# EasyEDA schematic LcsNodes-Extension-GPIO-Board-32-S-B.00.01.json

## Sheets
1 Connectors: TITLE: LcsNodes-Extension-Relais-Board-16-S\nConnectors; REV: B.00.01; Date: 2023-05-06; Sheet: 2/3; Drawn By: helmut-f; Company: Your Company
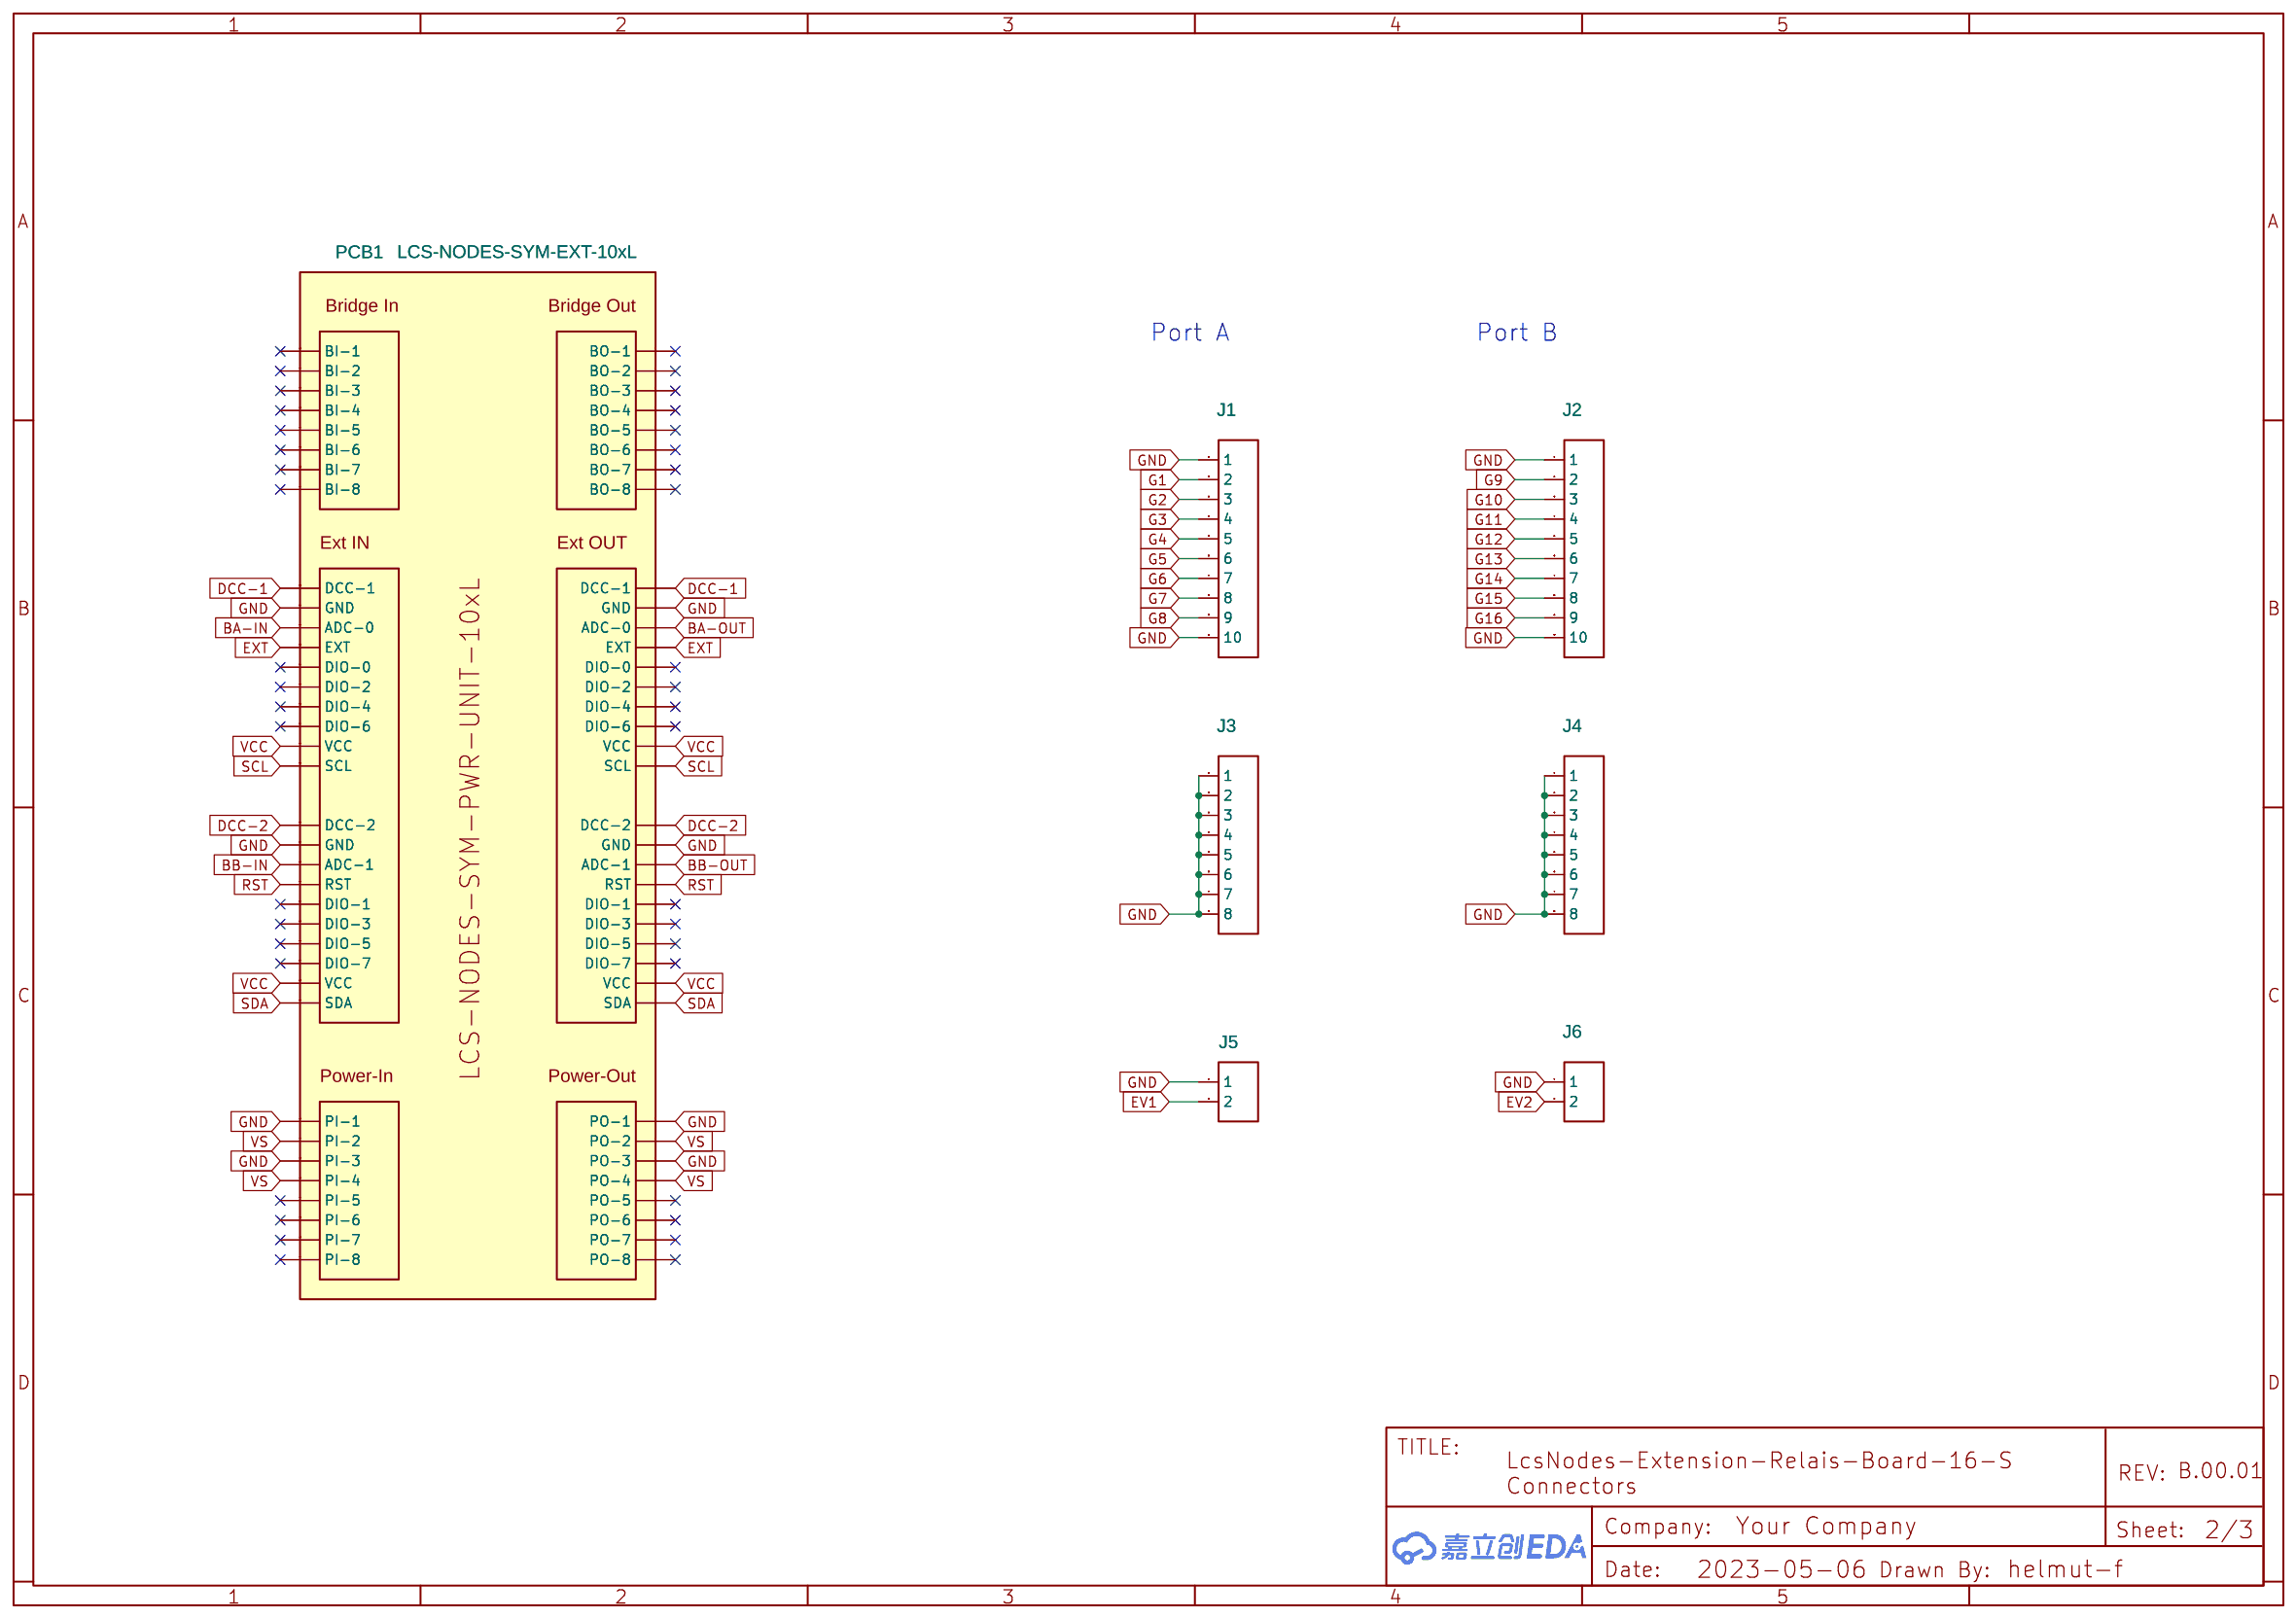
[diagram p0: Connectors]
2 Logic: TITLE: LcsNodes-Extension-Relais-Board16-S\nLogic; Date: 2023-05-07; Sheet: 3/3
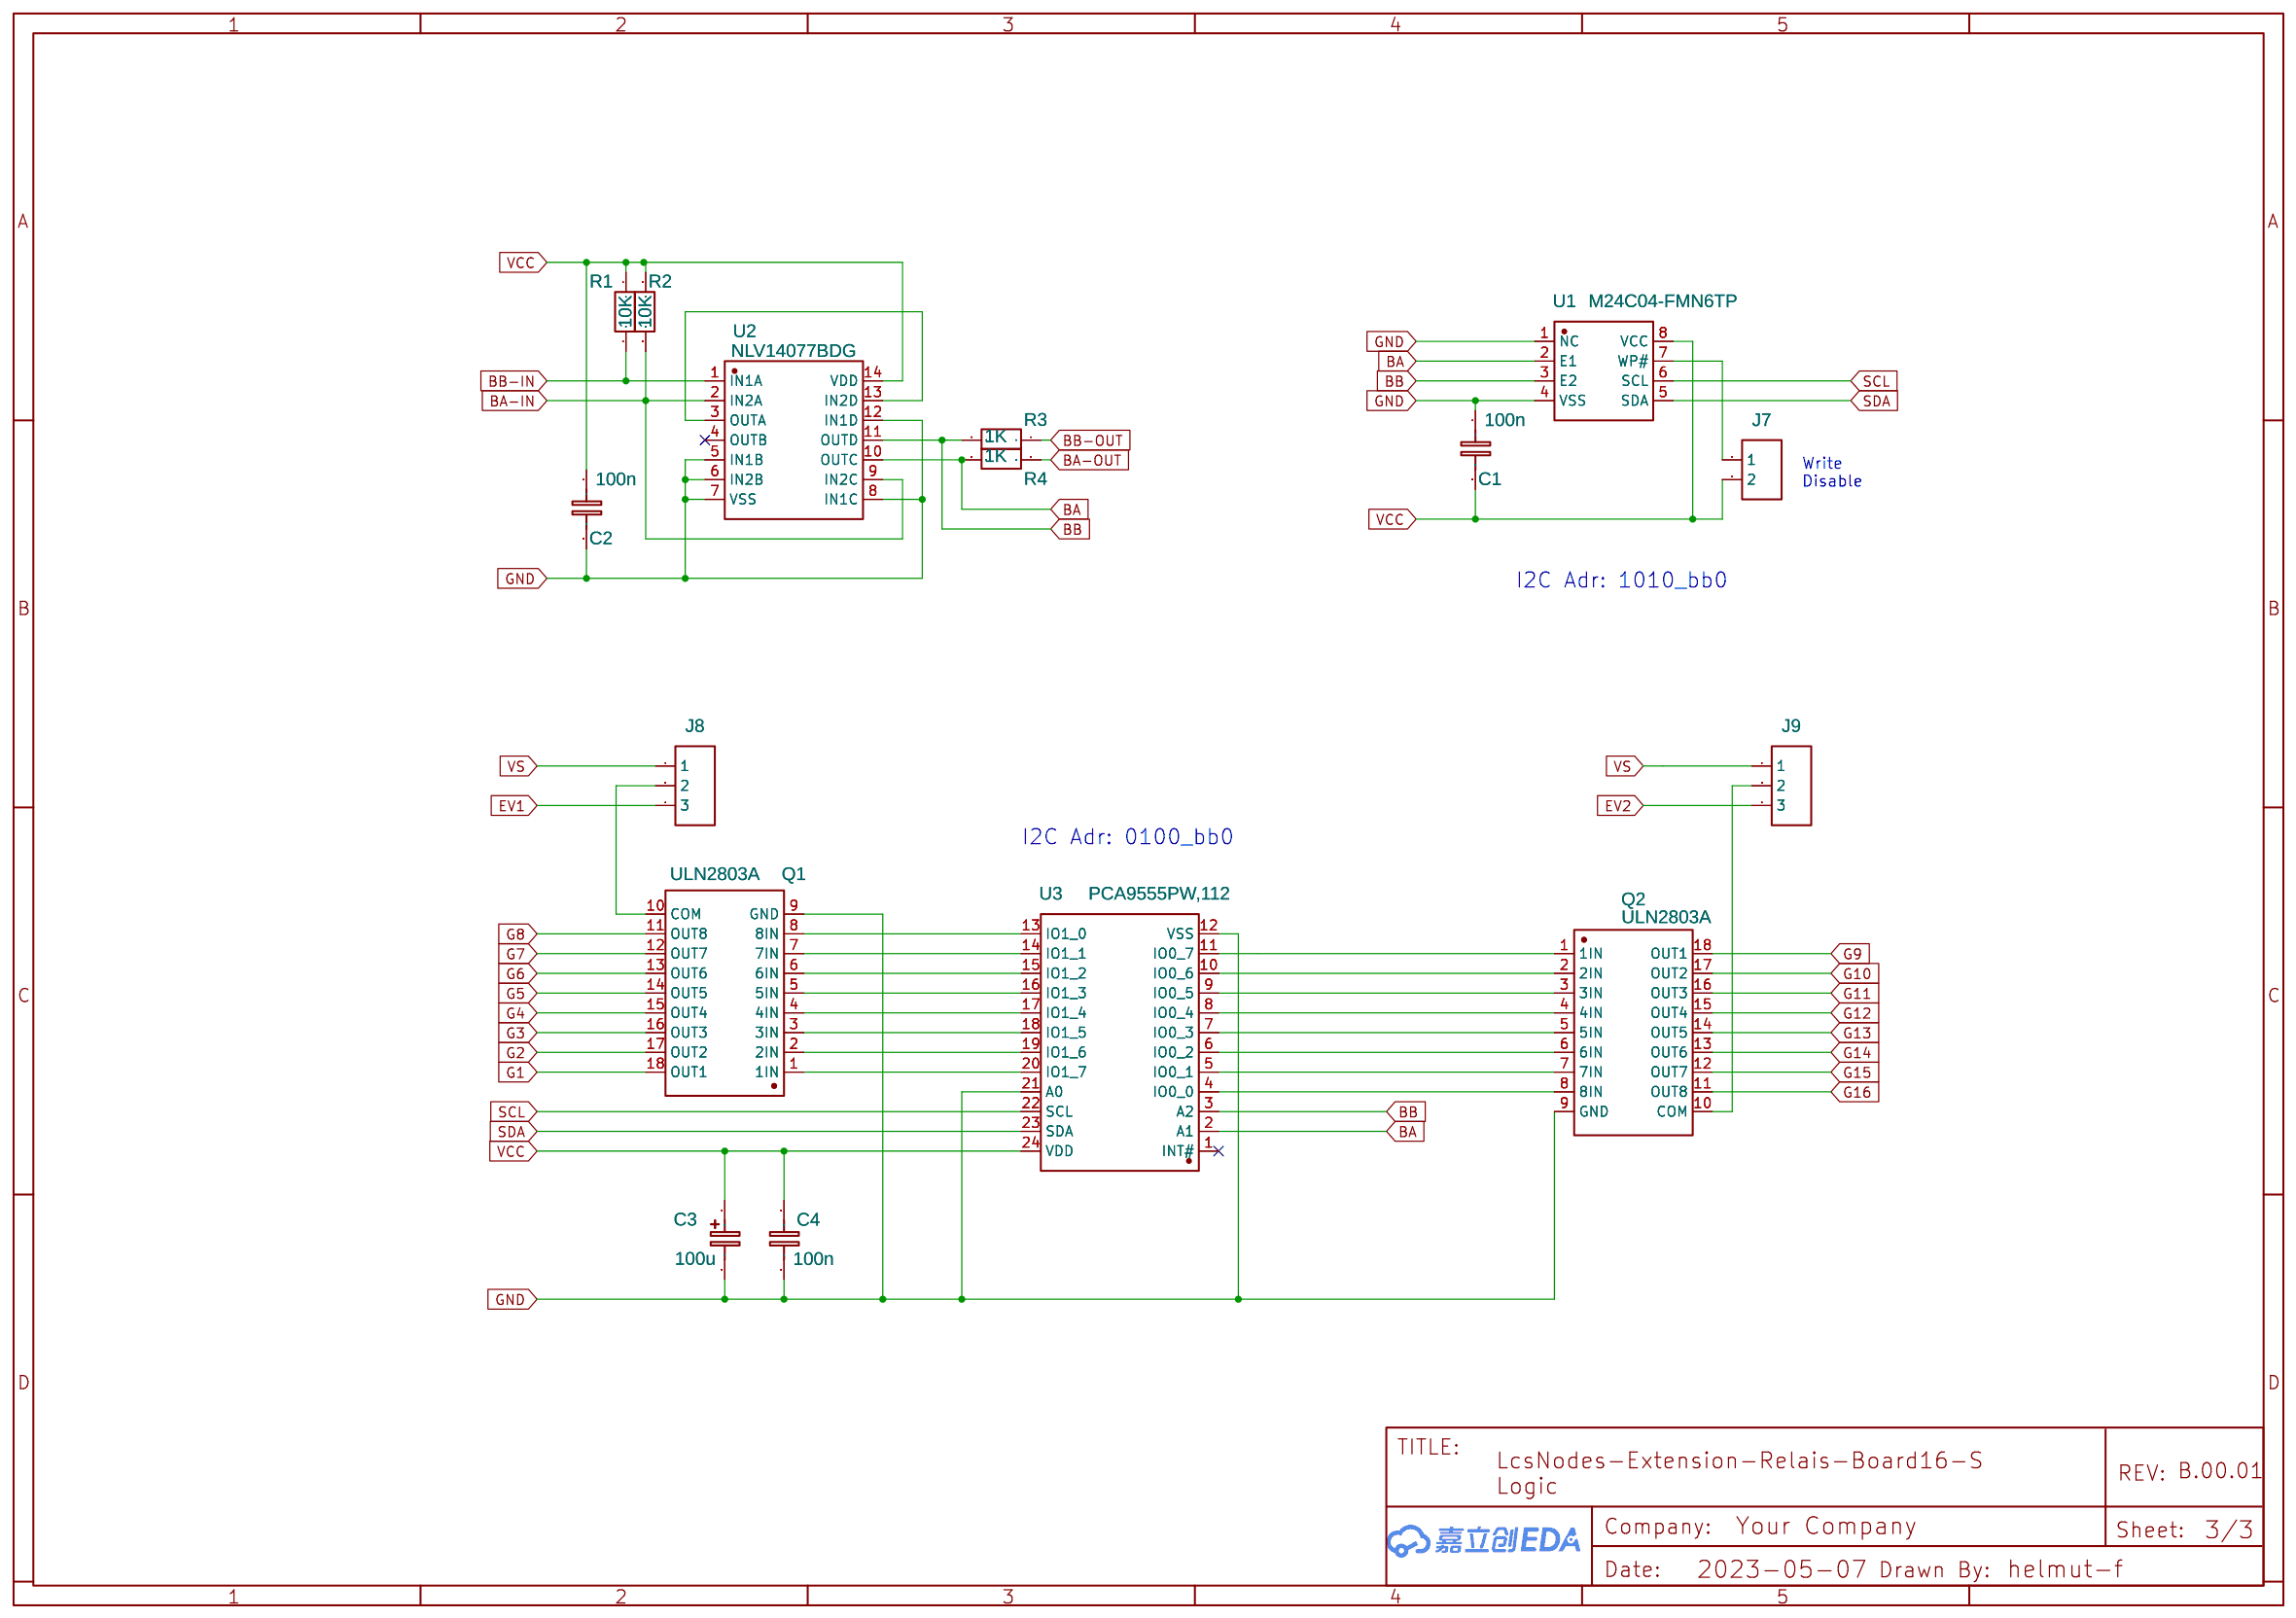
[diagram p1: Logic]
3 High Level Schematic: TITLE: LcsNodes-Extension-Relais-Board-16-S\nHigh Level Schematic; Date: 2023-02-08; Sheet: 1/3
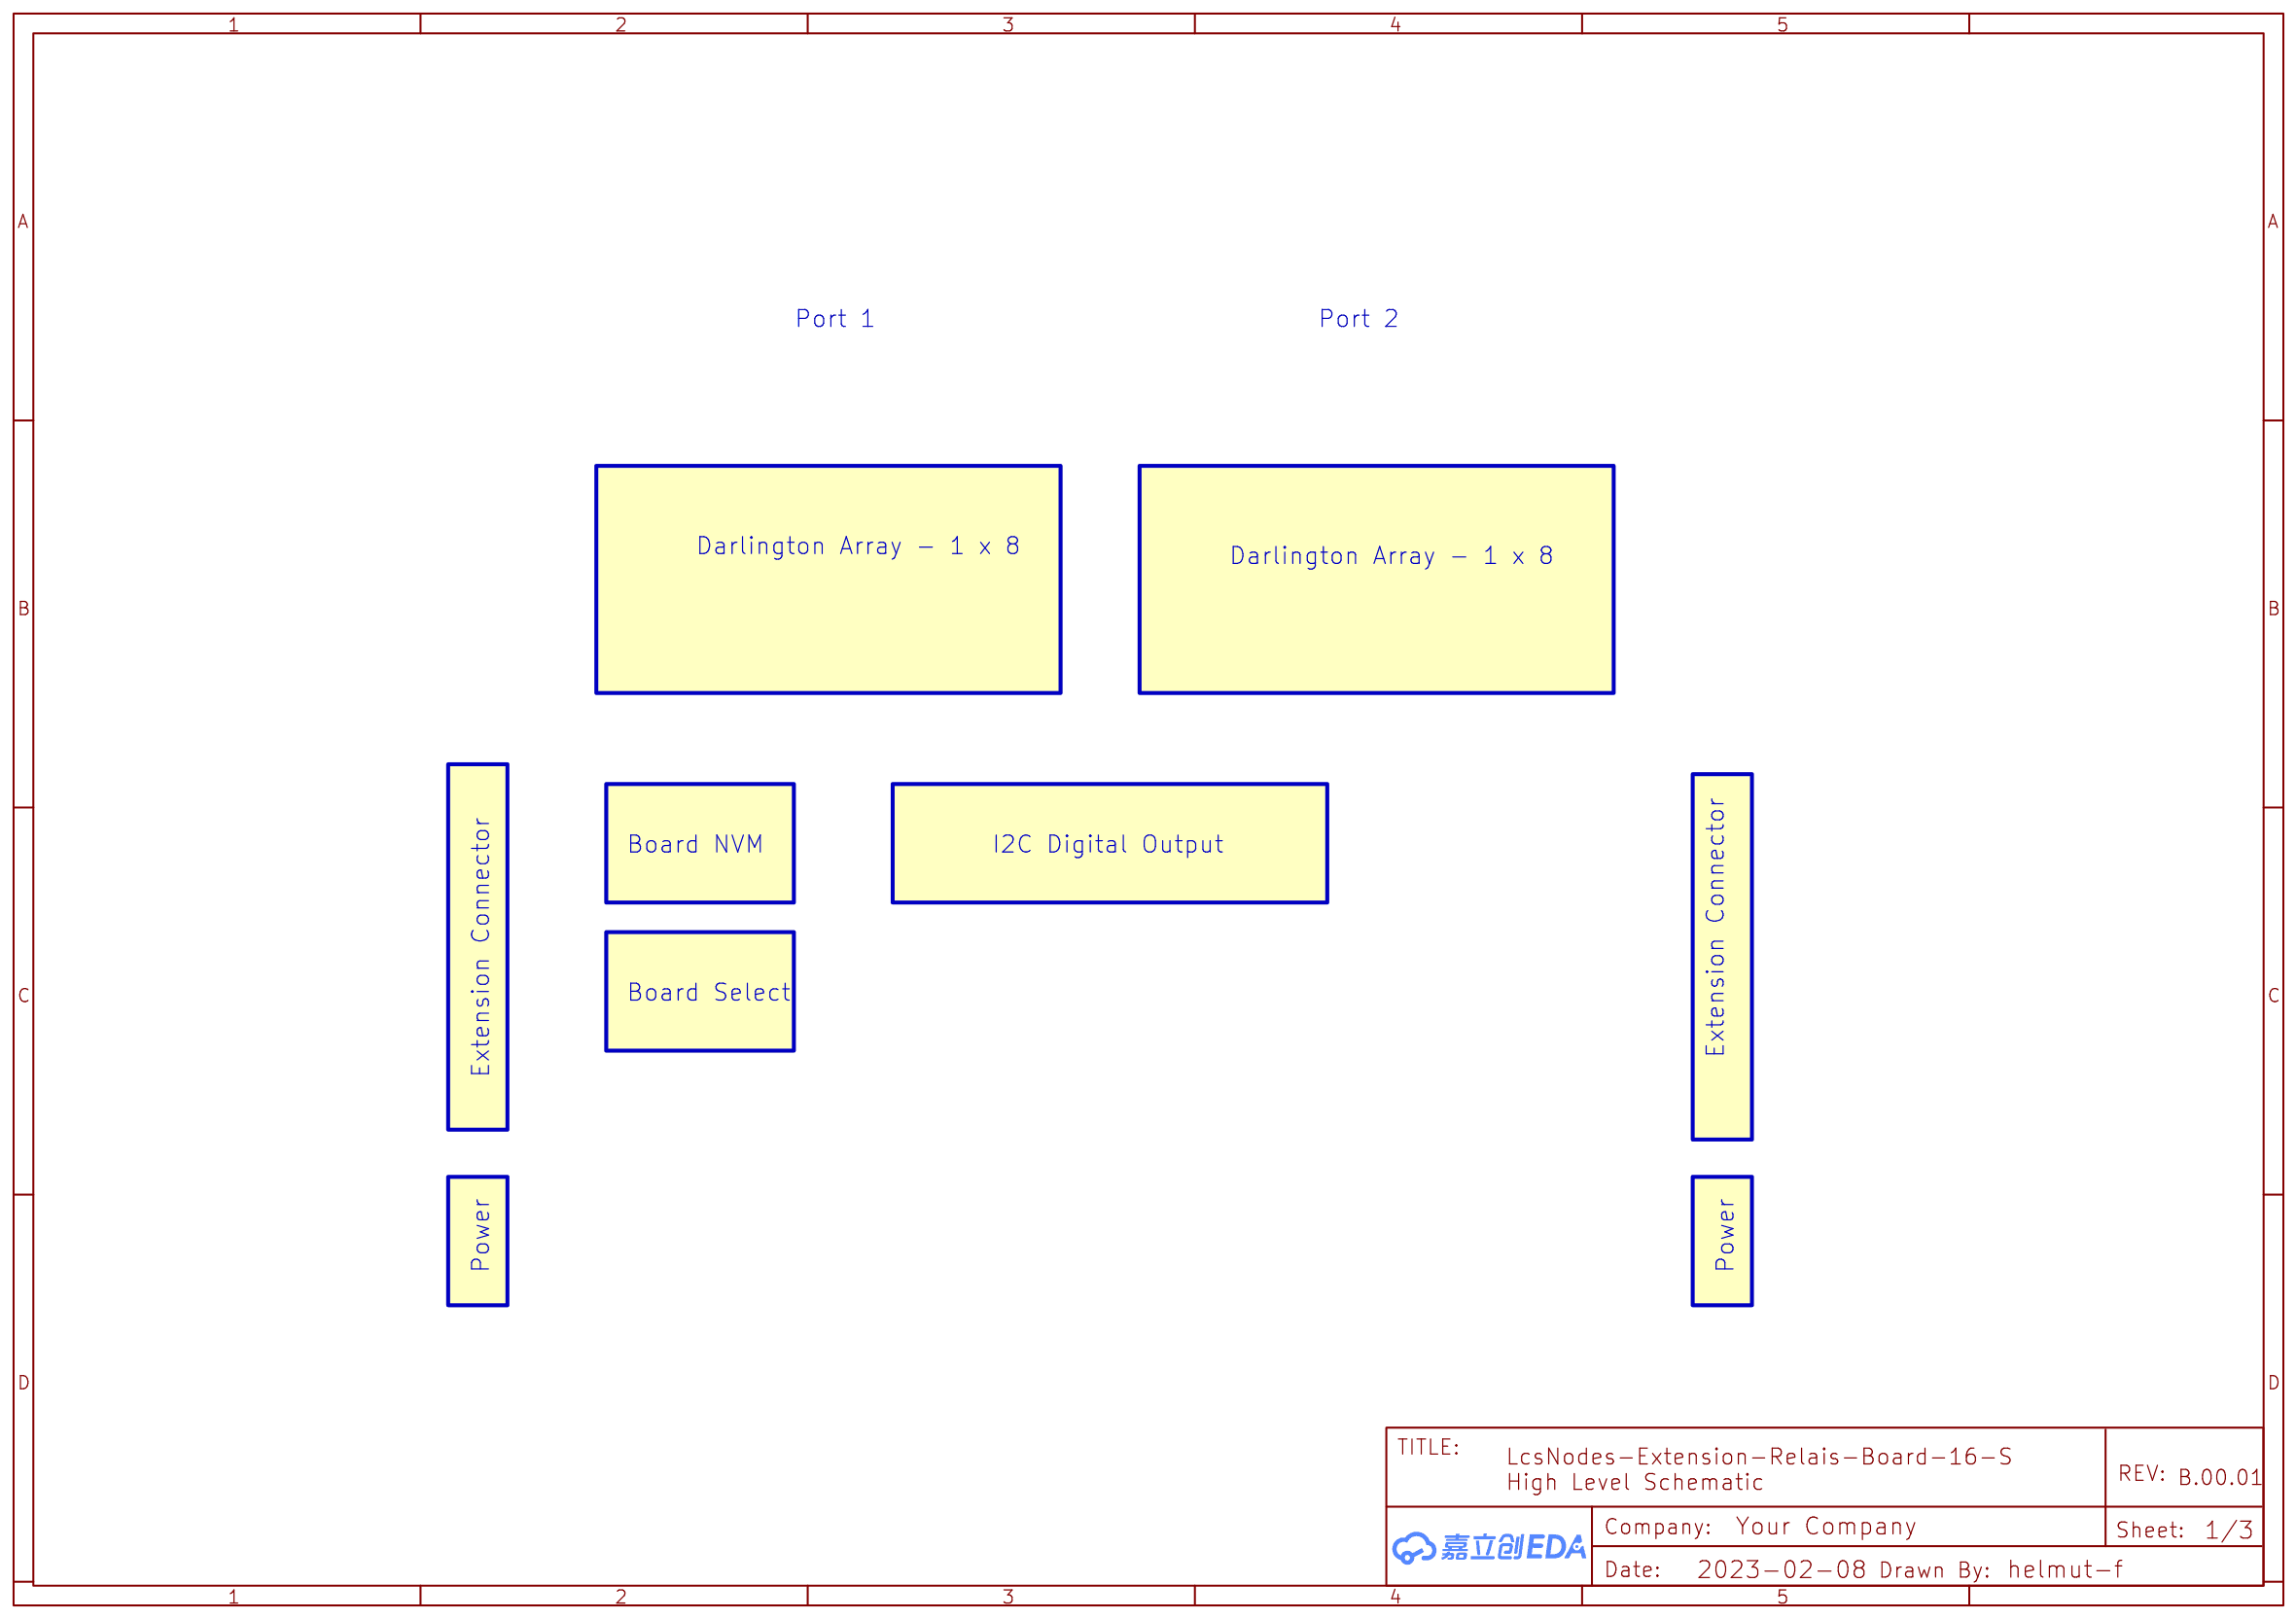
[diagram p2: High Level Schematic]

## Parts
sheet Connectors
J1  HDR-M-2.54_1x10  [HDR-M-2.54_1X10]
J2  HDR-M-2.54_1x10  [HDR-M-2.54_1X10]
J3  HDR-M-2.54_1x8  [HDR-M-2.54_1X8]
J4  HDR-M-2.54_1x8  [HDR-M-2.54_1X8]
J5  HDR-M-2.54_1x2  [HDR-M-2.54_1X2]
J6  HDR-M-2.54_1x2  [HDR-M-2.54_1X2]
PCB1  LCS-NODES-SYM-EXT-10xL  [LCS-NODES-FP-EXT-PCB-10X8]
sheet Logic
C1  100n  [C1206]
C2  100n  [C1206]
C3  100u  [CAP-SMD_BD6.3-L6.6-W6.6-LS7.6-FD]
C4  100n  [C1206]
J7  HDR-M-2.54_1x2  [HDR-M-2.54_1X2]
J8  HDR-M-2.54_1x3  [HDR-M-2.54_1X3]
J9  HDR-M-2.54_1x3  [HDR-M-2.54_1X3]
Q1  ULN2803A  [DIP-18_L23.0-W6.5-P2.54-LS7.6-BL]
Q2  ULN2803A  [DIP-18_L23.0-W6.5-P2.54-LS7.6-BL]
R1  10K  [R1206]
R2  10K  [R1206]
R3  1K  [R1206]
R4  1K  [R1206]
U1  M24C04-FMN6TP  [SOP-8_L5.0-W3.9-P1.27-LS6.0-BL]
U2  NLV14077BDG  [SOIC-14_L8.7-W3.9-P1.27-LS6.0-BL]
U3  PCA9555PW,112  [TSSOP-24_L7.8-W4.4-P0.65-LS6.4-BL]

## Library data of the parts
J1 J2 = HDR-M-2.54_1x10: Supplier Part: C57369; Supplier: LCSC; Contributor: LCEDA_Lib
J3 J4 = HDR-M-2.54_1x8: Supplier Part: C190820; Supplier: LCSC; Contributor: LCEDA_Lib
J5-J7 = HDR-M-2.54_1x2: Supplier Part: C124375; Supplier: LCSC; Contributor: LCEDA_Lib
PCB1 = LCS-NODES-SYM-EXT-10xL: Contributor: helmut-f
C1 C2 C4 = C_0603_EU: Contributor: LCEDA_Lib; Package Display: No
C3 = CE_TH_D4.0×F1.5_EU: Contributor: LCEDA_Lib
J8 J9 = HDR-M-2.54_1x3: Supplier Part: C180248; Supplier: LCSC; Contributor: LCEDA_Lib
Q1 Q2 = ULN2803A: Supplier: LCSC; Manufacturer: STMicroelectronics; Supplier Part: C73936; JLCPCB Part Class: Extended Part
R1-R4 = R_AXIAL-0.3_EU: Contributor: LCEDA_Lib
U1 = M24C04-FMN6TP: Supplier: LCSC; Supplier Part: C2062025; Manufacturer: ST(意法半导体); Contributor: LCSC; JLCPCB Part Class: Extended Part
U2 = NLV14077BDG: Supplier: LCSC; Supplier Part: C897321; Manufacturer: onsemi(安森美); Contributor: LCSC; JLCPCB Part Class: Extended Part
U3 = PCA9555PW,112: Supplier: LCSC; Supplier Part: C2688893; Manufacturer: NXP(恩智浦); Contributor: LCSC; JLCPCB Part Class: Extended Part

## Nets
GND: C1.1 C2.2 C3.2 C4.2 J1.1 J1.10 J2.1 J2.10 J3.1 J3.2 J3.3 J3.4 J3.5 J3.6 J3.7 J3.8 J4.1 J4.2 J4.3 J4.4 J4.5 J4.6 J4.7 J4.8 J5.1 J6.1 PCB1.21(GND) PCB1.31(GND) PCB1.40(PI-1) PCB1.42(PI-3) PCB1.61(GND) PCB1.71(GND) PCB1.80(PO-1) PCB1.82(PO-3) Q1.9(GND) Q2.9(GND) U1.1(NC) U1.4(VSS) U2.5(IN1B) U2.6(IN2B) U2.7(VSS) U2.8(IN1C) U2.12(IN1D) U3.12(VSS) U3.21(A0)
VCC: C1.2 C2.1 C3.1 C4.1 J7.2 PCB1.28(VCC) PCB1.38(VCC) PCB1.68(VCC) PCB1.78(VCC) R1.1 R2.1 U1.8(VCC) U2.14(VDD) U3.24(VDD)
BA: R4.2 U1.2(E1) U2.10(OUTC) U3.2(A1)
BA-IN: PCB1.22(ADC-0) R2.2 U2.2(IN2A) U2.9(IN2C)
BA-OUT: PCB1.62(ADC-0) R4.1
BB: R3.2 U1.3(E2) U2.11(OUTD) U3.3(A2)
BB-IN: PCB1.32(ADC-1) R1.2 U2.1(IN1A)
BB-OUT: PCB1.72(ADC-1) R3.1
DCC-1: PCB1.20(DCC-1) PCB1.60(DCC-1)
DCC-2: PCB1.30(DCC-2) PCB1.70(DCC-2)
EV1: J5.2 J8.3
EV2: J6.2 J9.3
EXT: PCB1.23(EXT) PCB1.63(EXT)
G1: J1.2 Q1.18(OUT1)
G2: J1.3 Q1.17(OUT2)
G3: J1.4 Q1.16(OUT3)
G4: J1.5 Q1.15(OUT4)
G5: J1.6 Q1.14(OUT5)
G6: J1.7 Q1.13(OUT6)
G7: J1.8 Q1.12(OUT7)
G8: J1.9 Q1.11(OUT8)
G9: J2.2 Q2.18(OUT1)
G10: J2.3 Q2.17(OUT2)
G11: J2.4 Q2.16(OUT3)
G12: J2.5 Q2.15(OUT4)
G13: J2.6 Q2.14(OUT5)
G14: J2.7 Q2.13(OUT6)
G15: J2.8 Q2.12(OUT7)
G16: J2.9 Q2.11(OUT8)
RST: PCB1.33(RST) PCB1.73(RST)
SCL: PCB1.29(SCL) PCB1.69(SCL) U1.6(SCL) U3.22(SCL)
SDA: PCB1.39(SDA) PCB1.79(SDA) U1.5(SDA) U3.23(SDA)
VS: J8.1 J9.1 PCB1.41(PI-2) PCB1.43(PI-4) PCB1.81(PO-2) PCB1.83(PO-4)
Net-(J7-1): J7.1 U1.7(WP#)
Net-(J8-2): J8.2 Q1.10(COM)
Net-(J9-2): J9.2 Q2.10(COM)
Net-(Q1-1): Q1.1(1IN) U3.20(IO1_7)
Net-(Q1-2): Q1.2(2IN) U3.19(IO1_6)
Net-(Q1-3): Q1.3(3IN) U3.18(IO1_5)
Net-(Q1-4): Q1.4(4IN) U3.17(IO1_4)
Net-(Q1-5): Q1.5(5IN) U3.16(IO1_3)
Net-(Q1-6): Q1.6(6IN) U3.15(IO1_2)
Net-(Q1-7): Q1.7(7IN) U3.14(IO1_1)
Net-(Q1-8): Q1.8(8IN) U3.13(IO1_0)
Net-(Q2-1): Q2.1(1IN) U3.11(IO0_7)
Net-(Q2-2): Q2.2(2IN) U3.10(IO0_6)
Net-(Q2-3): Q2.3(3IN) U3.9(IO0_5)
Net-(Q2-4): Q2.4(4IN) U3.8(IO0_4)
Net-(Q2-5): Q2.5(5IN) U3.7(IO0_3)
Net-(Q2-6): Q2.6(6IN) U3.6(IO0_2)
Net-(Q2-7): Q2.7(7IN) U3.5(IO0_1)
Net-(Q2-8): Q2.8(8IN) U3.4(IO0_0)
Net-(U2-3): U2.3(OUTA) U2.13(IN2D)

Not connected (* = marked no-connect by the designer): PCB1 10(BI-1)* 11(BI-2)* 12(BI-3)* 13(BI-4)* 14(BI-5)* 15(BI-6)* 16(BI-7)* 17(BI-8)* 24(DIO-0)* 25(DIO-2)* 26(DIO-4)* 27(DIO-6)* 34(DIO-1)* 35(DIO-3)* 36(DIO-5)* 37(DIO-7)* 44(PI-5)* 45(PI-6)* 46(PI-7)* 47(PI-8)* 50(BO-1)* 51(BO-2)* 52(BO-3)* 53(BO-4)* 54(BO-5)* 55(BO-6)* 56(BO-7)* 57(BO-8)* 64(DIO-0)* 65(DIO-2)* 66(DIO-4)* 67(DIO-6)* 74(DIO-1)* 75(DIO-3)* 76(DIO-5)* 77(DIO-7)* 84(PO-5)* 85(PO-6)* 86(PO-7)* 87(PO-8)*; U2 4(OUTB)*; U3 1(INT#)*

## Notes on the sheets
sheet 1
- Port A
- Port B
sheet 2
- Write
  Disable
- I2C Adr: 1010_bb0
- I2C Adr: 0100_bb0
sheet 3
- Port 1
- Port 2
- Darlington Array - 1 x 8
- Darlington Array - 1 x 8
- Board NVM
- I2C Digital Output
- Board Select
- Extension Connector
- Extension Connector
- Power
- Power
